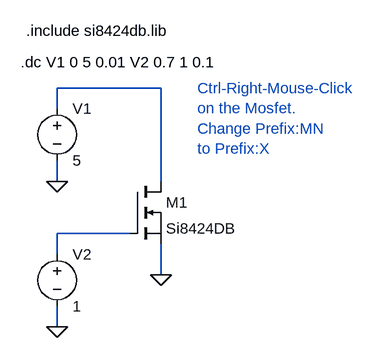
[diagram p0: schematic SI8424DB_test.asc]
SI8424DB_test.asc, the LTspice schematic file:
Version 4
SHEET 1 880 680
WIRE 288 -16 128 -16
WIRE 128 16 128 -16
WIRE 128 128 128 96
WIRE 288 128 288 -16
WIRE 240 208 128 208
WIRE 128 240 128 208
WIRE 288 272 288 224
WIRE 128 352 128 320
FLAG 128 128 0
FLAG 128 352 0
FLAG 288 272 0
SYMBOL nmos 240 128 R0
SYMATTR InstName M1
SYMATTR Value Si8424DB
SYMATTR Prefix X
SYMBOL voltage 128 0 R0
SYMATTR InstName V1
SYMATTR Value 5
SYMBOL voltage 128 224 R0
SYMATTR InstName V2
SYMATTR Value 1
TEXT 72 -56 Left 0 !.dc V1 0 5 0.01 V2 0.7 1 0.1
TEXT 80 -104 Left 0 !.include si8424db.lib
TEXT 344 -16 Left 0 ;Ctrl-Right-Mouse-Click \non the Mosfet.\nChange Prefix:MN\nto Prefix:X

The netlist it stands for:
* SI8424DB_test.asc
XM1 N001 N002 0 Si8424DB  ; pins D G S
V1 N001 0 5
V2 N002 0 1
.dc V1 0 5 0.01 V2 0.7 1 0.1
.include si8424db.lib
* Ctrl-Right-Mouse-Click
* on the Mosfet.
* Change Prefix:MN
* to Prefix:X
.backanno
.end